# EAGLE schematic Modulo de expansao (EAGLE 7.6.0)
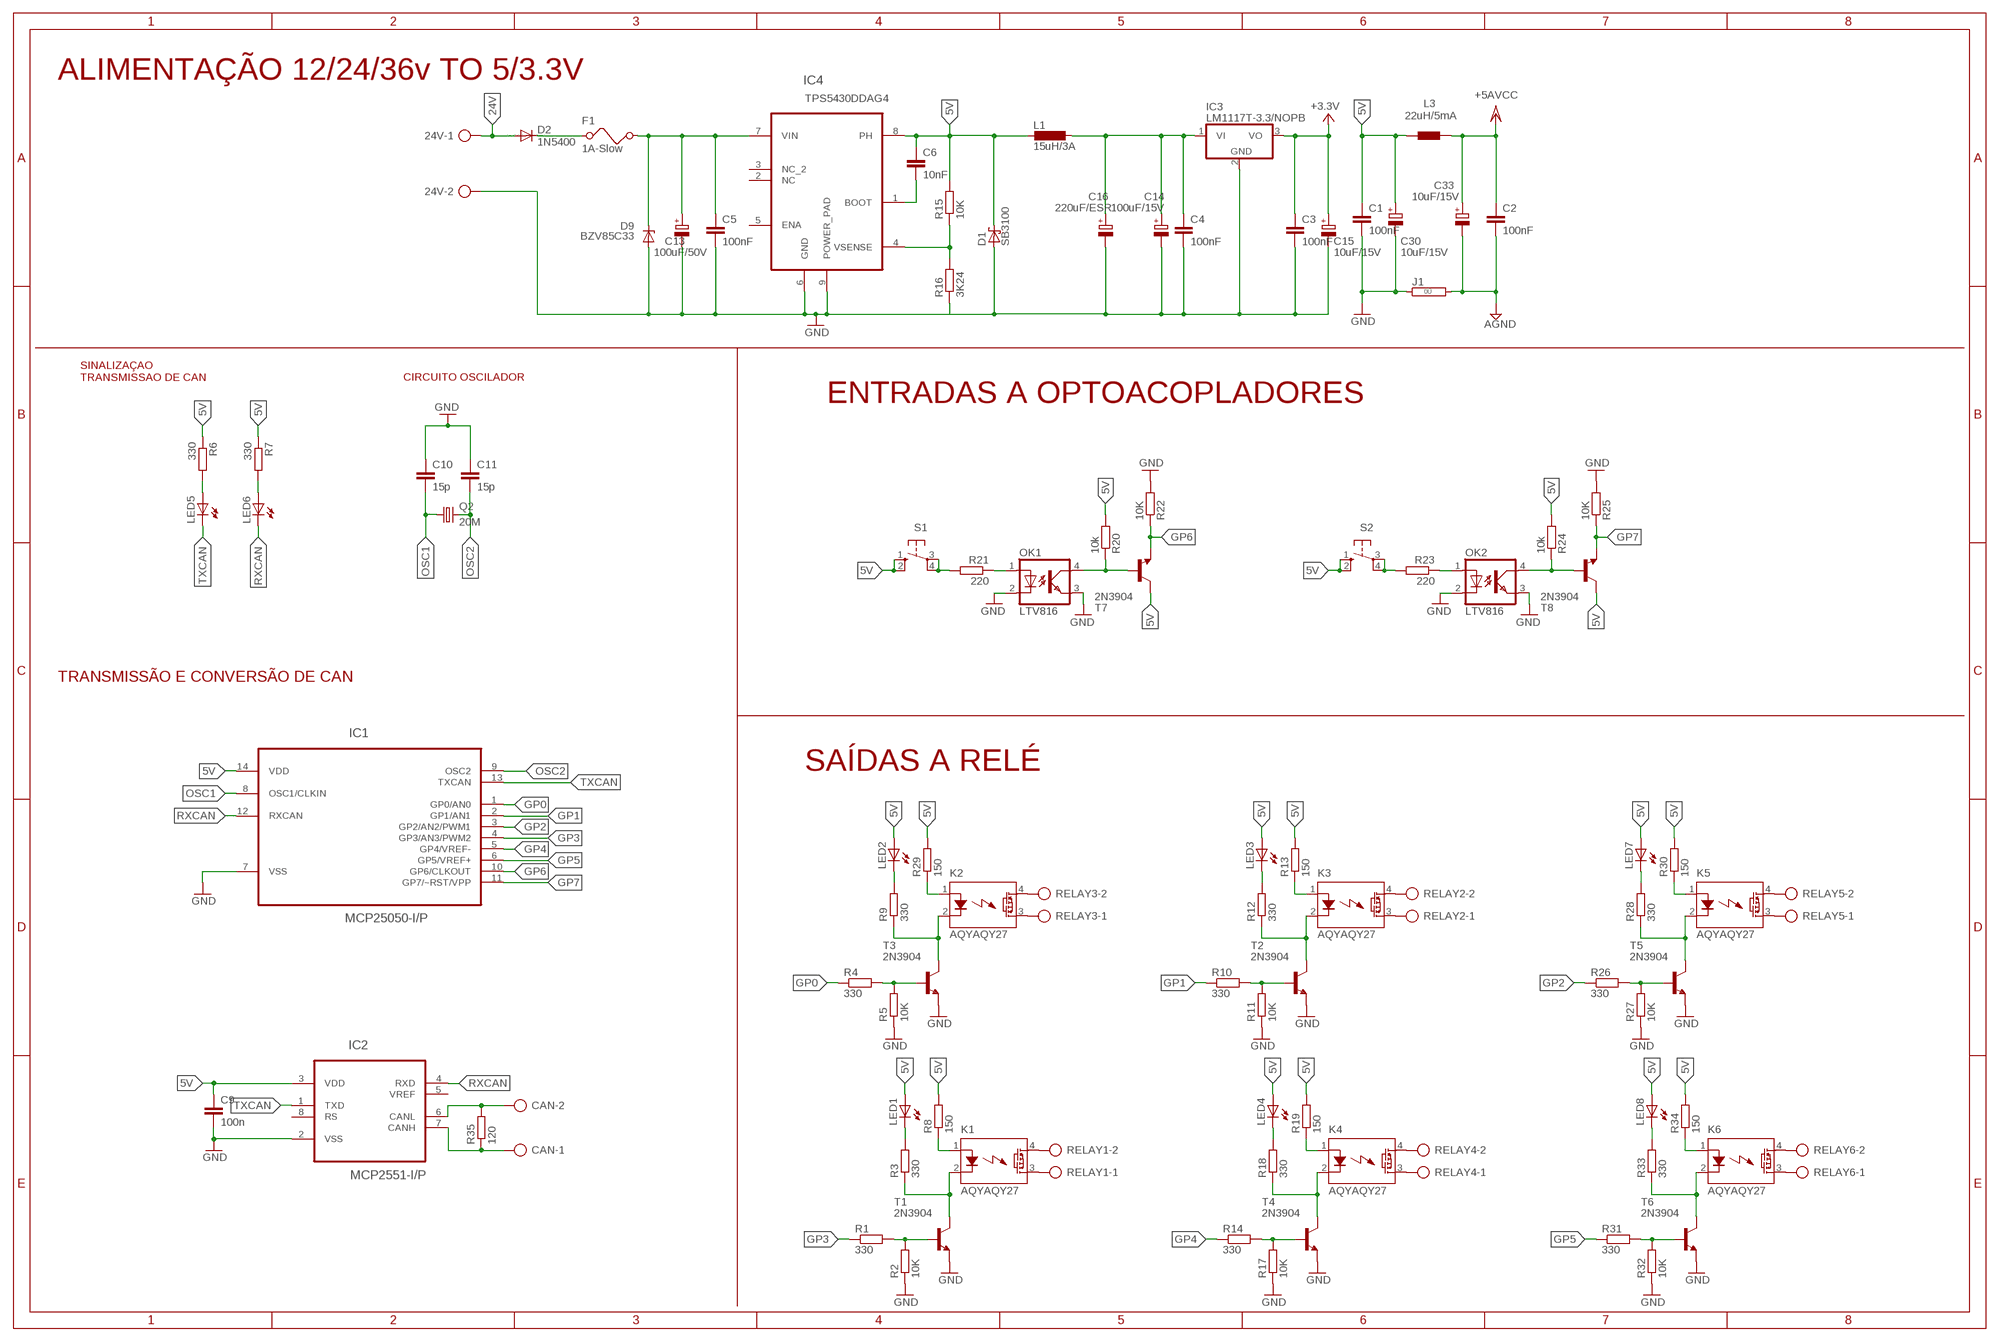
[diagram p0: schematic, sheet 1]

## Parts
24V  AK300/2  [AK300/2]
C1  100nF  C-EU050-024X044  [C050-024X044]
C2  100nF  C-EU050-024X044  [C050-024X044]
C3  100nF  C-EU050-024X044  [C050-024X044]
C4  100nF  C-EU050-024X044  [C050-024X044]
C5  100nF  C-EU050-024X044  [C050-024X044]
C6  10nF  C-EU075-032X103  [C075-032X103]
C9  100n  C-EU050-025X075  [C050-025X075]
C10  15p  C-EU025-024X044  [C025-024X044]
C11  15p  C-EU025-024X044  [C025-024X044]
C13  100uF/50V  CPOL-EUE5-10.5  [E5-10,5]
C14  100uF/15V  CPOL-EUE5-10.5  [E5-10,5]
C15  10uF/15V  CPOL-EUE5-10.5  [E5-10,5]
C16  220uF/ESR  CPOL-EUE5-10.5  [E5-10,5]
C30  10uF/15V  CPOL-EUE5-10.5  [E5-10,5]
C33  10uF/15V  CPOL-EUE5-10.5  [E5-10,5]
CAN  AK300/2  [AK300/2]
D1  SB3100  1N5908  [C4111-15]
D2  1N5400  [DO201-15]
D9  BZV85C33  ZENER-DIODEF126-10  [F126Z10]
F1  1A-Slow  FUSE  [FUSE]
IC1  MCP25050-I/P  [DIP254P762X432-14]
IC2  MCP2551-I/P  [DIP254P762X432-8]
IC3  LM1117T-3.3/NOPB  LM340H-12  [TO220H]
IC4  TPS5430DDAG4  [SOIC127P600X170-9N]
J1  0R  [0R/10]
K1  AQYAQY27  [AQY27]
K2  AQYAQY27  [AQY27]
K3  AQYAQY27  [AQY27]
K4  AQYAQY27  [AQY27]
K5  AQYAQY27  [AQY27]
K6  AQYAQY27  [AQY27]
L1  15uH/3A  L-EUTJ3-U1  [TJ3-U1]
L3  22uH/5mA  BL01RN1A  [BL01RN1A]
LED1  LED3MM  [LED3MM]
LED2  LED3MM  [LED3MM]
LED3  LED3MM  [LED3MM]
LED4  LED3MM  [LED3MM]
LED5  LED3MM  [LED3MM]
LED6  LED3MM  [LED3MM]
LED7  LED3MM  [LED3MM]
LED8  LED3MM  [LED3MM]
OK1  LTV816  [DIL04]
OK2  LTV816  [DIL04]
Q2  20M  CRYSTALHC49S  [HC49/S]
R1  330  R-EU_0204/5  [0204/5]
R2  10K  R-EU_0204/5  [0204/5]
R3  330  R-EU_0204/5  [0204/5]
R4  330  R-EU_0204/5  [0204/5]
R5  10K  R-EU_0204/5  [0204/5]
R6  330  R-EU_0204/5  [0204/5]
R7  330  R-EU_0204/5  [0204/5]
R8  150  R-EU_0204/5  [0204/5]
R9  330  R-EU_0204/5  [0204/5]
R10  330  R-EU_0204/5  [0204/5]
R11  10K  R-EU_0204/5  [0204/5]
R12  330  R-EU_0204/5  [0204/5]
R13  150  R-EU_0204/5  [0204/5]
R14  330  R-EU_0204/5  [0204/5]
R15  10K  R-EU_0204/7  [0204/7]
R16  3K24  R-EU_0204/7  [0204/7]
R17  10K  R-EU_0204/5  [0204/5]
R18  330  R-EU_0204/5  [0204/5]
R19  150  R-EU_0204/5  [0204/5]
R20  10k  R-EU_0204/5  [0204/5]
R21  220  R-EU_0204/5  [0204/5]
R22  10K  R-EU_0204/5  [0204/5]
R23  220  R-EU_0204/5  [0204/5]
R24  10k  R-EU_0204/5  [0204/5]
R25  10K  R-EU_0204/5  [0204/5]
R26  330  R-EU_0204/5  [0204/5]
R27  10K  R-EU_0204/5  [0204/5]
R28  330  R-EU_0204/5  [0204/5]
R29  150  R-EU_0204/5  [0204/5]
R30  150  R-EU_0204/5  [0204/5]
R31  330  R-EU_0204/5  [0204/5]
R32  10K  R-EU_0204/5  [0204/5]
R33  330  R-EU_0204/5  [0204/5]
R34  150  R-EU_0204/5  [0204/5]
R35  120  R-EU_0204/5  [0204/5]
RELAY1  AK300/2  [AK300/2]
RELAY2  AK300/2  [AK300/2]
RELAY3  AK300/2  [AK300/2]
RELAY4  AK300/2  [AK300/2]
RELAY5  AK300/2  [AK300/2]
RELAY6  AK300/2  [AK300/2]
S1  10-XX  [B3F-10XX]
S2  10-XX  [B3F-10XX]
T1  2N3904  [TO92]
T2  2N3904  [TO92]
T3  2N3904  [TO92]
T4  2N3904  [TO92]
T5  2N3904  [TO92]
T6  2N3904  [TO92]
T7  2N3904  [TO92]
T8  2N3904  [TO92]

## Nets
5V: C1.1 C6.1 C9.1 C30.+ D1.C IC1.14(VDD) IC2.3(VDD) IC4.8(PH) K1.1(A) K2.1(A) K3.1(A) K4.1(A) K5.1(A) K6.1(A) L1.2 L3.1 LED1.A LED2.A LED3.A LED4.A LED7.A LED8.A R6.1 R7.1 R8.1 R8.2 R13.1 R13.2 R15.2 R19.1 R19.2 R20.2 R24.2 R29.1 R29.2 R30.1 R30.2 R34.1 R34.2 S1.1(S) S1.2(S1) S2.1(S) S2.2(S1) T7.1(C) T8.1(C)
24V: 24V.1 D2.A
+3.3V: C3.1 C15.+ IC3.3(VO)
AGND: C2.2 C33.- J1.2
GND: 24V.2 C1.2 C3.2 C4.2 C5.2 C9.2 C10.1 C11.1 C13.- C14.- C15.- C16.- C30.- D1.A D9.A IC1.7(VSS) IC2.2(VSS) IC3.2(GND) IC4.6(GND) IC4.9(POWER_PAD) J1.1 OK1.2(C) OK1.3(EMIT) OK2.2(C) OK2.3(EMIT) R2.1 R5.1 R11.1 R16.1 R17.1 R22.2 R25.2 R27.1 R32.1 T1.3(E) T2.3(E) T3.3(E) T4.3(E) T5.3(E) T6.3(E)
GP0: IC1.1(GP0/AN0) R4.1
GP1: IC1.2(GP1/AN1) R10.1
GP2: IC1.3(GP2/AN2/PWM1) R26.1
GP3: IC1.4(GP3/AN3/PWM2) R1.1
GP4: IC1.5(GP4/VREF-) R14.1
GP5: IC1.6(GP5/VREF+) R31.1
GP6: IC1.10(GP6/CLKOUT) R22.1 T7.3(E)
GP7: IC1.11(GP7/~RST/VPP) R25.1 T8.3(E)
N$1: LED1.K(C) R3.2
N$2: K1.2(K) R3.1 T1.1(C)
N$3: R1.2 R2.2 T1.2(B)
N$4: K1.3(DS2) RELAY1.1
N$5: K1.4(DS1) RELAY1.2
N$6: LED3.K(C) R12.2
N$7: K3.2(K) R12.1 T2.1(C)
N$8: R10.2 R11.2 T2.2(B)
N$9: K3.3(DS2) RELAY2.1
N$10: R4.2 R5.2 T3.2(B)
N$11: LED2.K(C) R9.2
N$12: K2.2(K) R9.1 T3.1(C)
N$13: K2.3(DS2) RELAY3.1
N$14: K2.4(DS1) RELAY3.2
N$15: K3.4(DS1) RELAY2.2
N$16: LED4.K(C) R18.2
N$17: K4.2(K) R18.1 T4.1(C)
N$18: R14.2 R17.2 T4.2(B)
N$19: K4.3(DS2) RELAY4.1
N$20: K4.4(DS1) RELAY4.2
N$21: C5.1 C13.+ D9.C F1.2 IC4.7(VIN)
N$22: LED7.K(C) R28.2
N$23: D2.C F1.1
N$24: LED5.A R6.2
N$25: LED6.A R7.2
N$26: K5.2(K) R28.1 T5.1(C)
N$27: R26.2 R27.2 T5.2(B)
N$28: K5.3(DS2) RELAY5.1
N$29: K5.4(DS1) RELAY5.2
N$30: LED8.K(C) R33.2
N$31: CAN.2 IC2.6(CANL) R35.2
N$32: CAN.1 IC2.7(CANH) R35.1
N$33: K6.2(K) R33.1 T6.1(C)
N$34: R31.2 R32.2 T6.2(B)
N$35: K6.3(DS2) RELAY6.1
N$36: K6.4(DS1) RELAY6.2
N$37: OK1.4(COL) R20.1 T7.2(B)
N$38: R23.2 S2.3(P) S2.4(P1)
N$39: OK2.1(A) R23.1
N$40: OK2.4(COL) R24.1 T8.2(B)
N$57: R21.2 S1.3(P) S1.4(P1)
N$59: OK1.1(A) R21.1
N$65: C4.1 C14.+ C16.+ IC3.1(VI) L1.1
N$66: C6.2 IC4.1(BOOT)
N$67: IC4.4(VSENSE) R15.1 R16.2
OSC1: C10.2 IC1.8(OSC1/CLKIN) Q2.1
OSC2: C11.2 IC1.9(OSC2) Q2.2
RXCAN: IC1.12(RXCAN) IC2.4(RXD) LED6.K(C)
TXCAN: IC1.13(TXCAN) IC2.1(TXD) LED5.K(C)
VCC/2: C2.1 C33.+ L3.2 ; supply symbol labelled +5AVCC
Unconnected: IC2.5(VREF) IC2.8(RS) IC4.2(NC) IC4.3(NC_2) IC4.5(ENA)

## Notes on the sheet
- ALIMENTAÇÃO 12/24/36v TO 5/3.3V
- SINALIZAÇAO
  TRANSMISSAO DE CAN
- CIRCUITO OSCILADOR
- ENTRADAS A OPTOACOPLADORES
- TRANSMISSÃO E CONVERSÃO DE CAN
- SAÍDAS A RELÉ

## Library data of the parts
24V CAN RELAY1-RELAY6 = con-ptr500:AK300/2: CONNECTOR; OC_FARNELL: unknown; OC_NEWARK: unknown
C1-C6 C9-C11 = rcl:C-EU: CAPACITOR, European symbol
C13-C16 C30 C33 = rcl:CPOL-EU: POLARIZED CAPACITOR, European symbol
D1 = diode:1N5908: DIODE schottky
D2 = diode:1N5400: DIODE standard rectifier, 3 A, 50 V (Motorola)
D9 = diode:ZENER-DIODE: Z-Diode
F1 = special:FUSE: FUSE 5 x 20 mm
IC1 = MCP25050-IP:MCP25050-I/P: CAN I/O Expander Family; MPN: MCP25050-I/P; OC_FARNELL: 1439736; OC_NEWARK: 59K0224; PACKAGE: DIP-14; SUPPLIER: Microchip
IC2 = MCP2551-IP:MCP2551-I/P: High-Speed CAN Transceiver; DESCRIPTION: CAN CTRL; MPN: MCP2551-I/P; OC_FARNELL: 1292240; OC_NEWARK: 61K2947; PACKAGE: PDIP-8; SUPPLIER: Microchip
IC3 = linear:LM340?-*: Positive VOLTAGE REGULATOR Source: http://cache.national.com/ds/LM/LM340.pdf
IC4 = texas_tps5430:TPS5430DDAG4: 3-A, WIDE INPUT RANGE, STEP-DOWN SWIFT CONVERTER; MPN: TPS5430DDAG4; OC_FARNELL: 1220987; OC_NEWARK: 05M1620; PACKAGE: SOIC-8; SUPPLIER: TEXAS INSTRUMENTS
J1 = jumper:0R: Bridge 0R 10mm
K1-K6 = relay:AQY*: PhotoMOS Relay NAiS Source: http://www.panasonic-electric-works.com/catalogues/downloads/photomos/ds_x615_en_aqz10_20.pdf; OC_FARNELL: unknown; OC_NEWARK: unknown
L1 = rcl:L-EU: INDUCTOR, European symbol
L3 = inductors:BL0: Noise Suppression Products/EMI Suppression Filters, Lead EMIFIL(R) Inductor Type Source: http://www.murata.com .. BL01RN1_DS.pdf
LED1-LED8 = led:LED: LED OSRAM: - CHIPLED LG R971, LG N971, LY N971, LG Q971, LY Q971, LO R971, LY R971 LH N974, LH R974 LS Q976, LO Q976, LY Q976 LO Q996 - Hyper CHIPLED LW Q18S LB Q993, LB Q99A, LB R99A - SideLED LS A670, LO A670, LY A670, LG A670, LP A670 LB A673, LV A673, LT A673, LW A673 LH A674 LY A675 LS A676, LA A676, LO A676, LY A676, LW A676 LS A679, LY A679, LG A679 - Hyper Micro SIDELED® LS Y876, LA Y876, LO Y876, LY Y876 LT Y87S - SmartLED LW L88C, LW L88S LB L89C, LB L89S, LG L890 LS L89K, LO L89K, LY L89K LS L896, LA L896, LO L896, LY L896 - TOPLED LS T670, LO T670, LY T670, LG T670, LP T670 LSG T670, LSP T670, LSY T670, LOP T670, LYG T670 LG T671, LOG T671, LSG T671 LB T673, LV T673, LT T673, LW T673 LH T674 LS T676, LA T676, LO T676, LY T676, LB T676, LH T676, LSB T676, LW T676 LB T67C, LV T67C, LT T67C, LS T67K, LO T67K, LY T67K, LW E67C LS E67B, LA E67B, LO E67B, LY E67B, LB E67C, LV E67C, LT E67C LW T67C LS T679, LY T679, LG T679 LS T770, LO T770, LY T770, LG T770, LP T770 LB T773, LV T773, LT T773, LW T773 LH T774 LS E675, LA E675, LY E675, LS T675 LS T776, LA T776, LO T776, LY T776, LB T776 LHGB T686 LT T68C, LB T68C - Hyper Mini TOPLED® LB M676 - Mini TOPLED Santana® LG M470 LS M47K, LO M47K, LY M47K Source: http://www.osram.convergy.de LUXEON: - LUMILED® LXK2-PW12-R00, LXK2-PW12-S00, LXK2-PW14-U00, LXK2-PW14-V00 LXK2-PM12-R00, LXK2-PM12-S00, LXK2-PM14-U00 LXK2-PE12-Q00, LXK2-PE12-R00, LXK2-PE12-S00, LXK2-PE14-T00, LXK2-PE14-U00 LXK2-PB12-K00, LXK2-PB12-L00, LXK2-PB12-M00, LXK2-PB14-N00, LXK2-PB14-P00, LXK2-PB14-Q00 LXK2-PR12-L00, LXK2-PR12-M00, LXK2-PR14-Q00, LXK2-PR14-R00 LXK2-PD12-Q00, LXK2-PD12-R00, LXK2-PD12-S00 LXK2-PH12-R00, LXK2-PH12-S00 LXK2-PL12-P00, LXK2-PL12-Q00, LXK2-PL12-R00 Source: www.luxeon.com KINGBRIGHT: KA-3528ASYC Source: www.kingbright.com
OK1 OK2 = optocoupler:LTV816: OPTO COUPLER Source: LITEON, LTV816.pdf; OC_FARNELL: unknown; OC_NEWARK: unknown
Q2 = crystal:CRYSTAL: CRYSTAL; OC_FARNELL: 1667008; OC_NEWARK: unknown
R1-R35 = rcl:R-EU_: RESISTOR, European symbol
S1 S2 = switch-omron:10-XX: OMRON SWITCH; MPN: B3F-1000; OC_FARNELL: 176432; OC_NEWARK: 36M3542
T1-T8 = transistor:2N3904: NPN TRANSISTOR